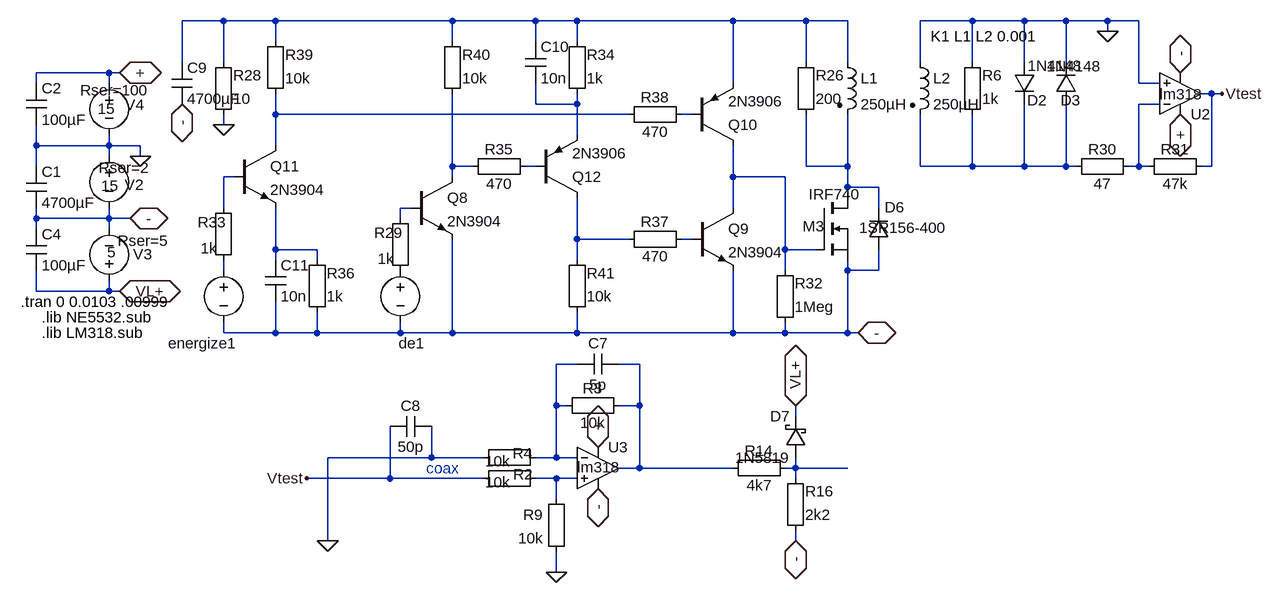
[diagram p0: schematic metal_low_power_fast_switch_5001.asc]
metal_low_power_fast_switch_5001.asc, the LTspice schematic file:
Version 4
SHEET 1 6068 1612
WIRE 96 -2432 32 -2432
WIRE 176 -2432 96 -2432
WIRE 448 -2432 176 -2432
WIRE 576 -2432 448 -2432
WIRE 640 -2432 576 -2432
WIRE 880 -2432 640 -2432
WIRE 992 -2432 880 -2432
WIRE 1056 -2432 992 -2432
WIRE 1248 -2432 1168 -2432
WIRE 1328 -2432 1248 -2432
WIRE 1392 -2432 1328 -2432
WIRE 1456 -2432 1392 -2432
WIRE 1504 -2432 1456 -2432
WIRE 1456 -2416 1456 -2432
WIRE 176 -2400 176 -2432
WIRE 448 -2400 448 -2432
WIRE 576 -2400 576 -2432
WIRE 640 -2400 640 -2432
WIRE 32 -2368 32 -2432
WIRE 96 -2368 96 -2432
WIRE 992 -2368 992 -2432
WIRE 1056 -2368 1056 -2432
WIRE 1168 -2368 1168 -2432
WIRE 1248 -2368 1248 -2432
WIRE 1328 -2368 1328 -2432
WIRE 1392 -2368 1392 -2432
WIRE -80 -2352 -192 -2352
WIRE -64 -2352 -80 -2352
WIRE -192 -2336 -192 -2352
WIRE -80 -2336 -80 -2352
WIRE 880 -2336 880 -2432
WIRE 1504 -2336 1504 -2432
WIRE 1536 -2336 1504 -2336
WIRE 1616 -2320 1600 -2320
WIRE 1632 -2320 1616 -2320
WIRE 576 -2304 576 -2336
WIRE 640 -2304 640 -2320
WIRE 640 -2304 576 -2304
WIRE 1536 -2304 1504 -2304
WIRE 176 -2288 176 -2320
WIRE 720 -2288 176 -2288
WIRE 816 -2288 800 -2288
WIRE 96 -2272 96 -2288
WIRE 640 -2256 640 -2304
WIRE -192 -2240 -192 -2272
WIRE -80 -2240 -80 -2256
WIRE -80 -2240 -192 -2240
WIRE -32 -2240 -80 -2240
WIRE 176 -2240 176 -2288
WIRE -80 -2224 -80 -2240
WIRE -32 -2224 -32 -2240
WIRE -192 -2208 -192 -2240
WIRE 448 -2208 448 -2320
WIRE 480 -2208 448 -2208
WIRE 576 -2208 560 -2208
WIRE 992 -2208 992 -2288
WIRE 1056 -2208 1056 -2288
WIRE 1056 -2208 992 -2208
WIRE 1168 -2208 1168 -2288
WIRE 1248 -2208 1248 -2288
WIRE 1248 -2208 1168 -2208
WIRE 1328 -2208 1328 -2304
WIRE 1328 -2208 1248 -2208
WIRE 1392 -2208 1392 -2304
WIRE 1392 -2208 1328 -2208
WIRE 1408 -2208 1392 -2208
WIRE 1504 -2208 1504 -2304
WIRE 1504 -2208 1488 -2208
WIRE 1520 -2208 1504 -2208
WIRE 1616 -2208 1616 -2320
WIRE 1616 -2208 1600 -2208
WIRE 112 -2192 96 -2192
WIRE 448 -2192 448 -2208
WIRE 880 -2192 880 -2240
WIRE 960 -2192 880 -2192
WIRE 1056 -2176 1056 -2208
WIRE 1104 -2176 1056 -2176
WIRE 1056 -2160 1056 -2176
WIRE 96 -2144 96 -2192
WIRE 384 -2144 368 -2144
WIRE 880 -2144 880 -2192
WIRE 1104 -2144 1104 -2176
WIRE -192 -2128 -192 -2144
WIRE -80 -2128 -80 -2144
WIRE -80 -2128 -192 -2128
WIRE -48 -2128 -80 -2128
WIRE 368 -2128 368 -2144
WIRE -192 -2112 -192 -2128
WIRE -80 -2112 -80 -2128
WIRE 640 -2096 640 -2160
WIRE 720 -2096 640 -2096
WIRE 816 -2096 800 -2096
WIRE 176 -2080 176 -2144
WIRE 240 -2080 176 -2080
WIRE 960 -2080 960 -2192
WIRE 1008 -2080 960 -2080
WIRE 176 -2064 176 -2080
WIRE 240 -2064 240 -2080
WIRE 640 -2064 640 -2096
WIRE 96 -2048 96 -2064
WIRE 960 -2048 960 -2080
WIRE 1056 -2048 1056 -2064
WIRE 1104 -2048 1104 -2080
WIRE 1104 -2048 1056 -2048
WIRE -192 -2016 -192 -2048
WIRE -80 -2016 -80 -2032
WIRE -80 -2016 -192 -2016
WIRE -64 -2016 -80 -2016
WIRE 96 -1952 96 -1968
WIRE 176 -1952 176 -2000
WIRE 176 -1952 96 -1952
WIRE 240 -1952 240 -1984
WIRE 240 -1952 176 -1952
WIRE 368 -1952 368 -1968
WIRE 368 -1952 240 -1952
WIRE 448 -1952 448 -2096
WIRE 448 -1952 368 -1952
WIRE 640 -1952 640 -1984
WIRE 640 -1952 448 -1952
WIRE 880 -1952 880 -2048
WIRE 880 -1952 640 -1952
WIRE 960 -1952 960 -1968
WIRE 960 -1952 880 -1952
WIRE 1056 -1952 1056 -2048
WIRE 1056 -1952 960 -1952
WIRE 1072 -1952 1056 -1952
WIRE 640 -1904 608 -1904
WIRE 736 -1904 704 -1904
WIRE 608 -1840 608 -1904
WIRE 624 -1840 608 -1840
WIRE 736 -1840 736 -1904
WIRE 736 -1840 704 -1840
WIRE 976 -1824 976 -1840
WIRE 416 -1760 416 -1808
WIRE 416 -1760 256 -1760
WIRE 496 -1760 416 -1760
WIRE 608 -1760 608 -1840
WIRE 608 -1760 576 -1760
WIRE 640 -1760 608 -1760
WIRE 736 -1744 736 -1840
WIRE 736 -1744 704 -1744
WIRE 880 -1744 736 -1744
WIRE 976 -1744 976 -1760
WIRE 976 -1744 960 -1744
WIRE 1056 -1744 976 -1744
WIRE 352 -1728 352 -1808
WIRE 352 -1728 224 -1728
WIRE 496 -1728 352 -1728
WIRE 608 -1728 576 -1728
WIRE 640 -1728 608 -1728
WIRE 976 -1728 976 -1744
WIRE 608 -1696 608 -1728
WIRE 256 -1632 256 -1760
WIRE 976 -1632 976 -1648
WIRE 608 -1584 608 -1616
FLAG -48 -2128 -
IOPIN -48 -2128 BiDir
FLAG -64 -2352 +
IOPIN -64 -2352 BiDir
FLAG -32 -2224 0
FLAG -64 -2016 VL+
IOPIN -64 -2016 BiDir
FLAG 976 -1632 -
IOPIN 976 -1632 BiDir
FLAG 976 -1840 VL+
IOPIN 976 -1840 BiDir
FLAG 672 -1776 +
IOPIN 672 -1776 BiDir
FLAG 672 -1712 -
IOPIN 672 -1712 BiDir
FLAG 224 -1728 Vtest
FLAG 608 -1584 0
FLAG 256 -1632 0
FLAG 32 -2304 -
IOPIN 32 -2304 BiDir
FLAG 96 -2272 0
FLAG 1568 -2288 +
IOPIN 1568 -2288 BiDir
FLAG 1568 -2352 -
IOPIN 1568 -2352 BiDir
FLAG 1072 -1952 -
IOPIN 1072 -1952 BiDir
FLAG 1632 -2320 Vtest
FLAG 1456 -2416 0
SYMBOL voltage -80 -2240 M0
WINDOW 123 0 0 Left 2
WINDOW 39 -63 34 Left 2
WINDOW 0 -53 60 Left 2
WINDOW 3 -15 62 Left 2
SYMATTR SpiceLine Rser=2
SYMATTR InstName V2
SYMATTR Value 15
SYMBOL voltage -80 -2352 M0
WINDOW 123 0 0 Left 2
WINDOW 39 -61 27 Left 2
WINDOW 0 -54 49 Left 2
WINDOW 3 -9 55 Left 2
SYMATTR SpiceLine Rser=100
SYMATTR InstName V4
SYMATTR Value 15
SYMBOL voltage -80 -2016 M180
WINDOW 123 0 0 Left 2
WINDOW 39 13 78 Left 2
WINDOW 0 37 57 Left 2
WINDOW 3 -3 60 Left 2
SYMATTR SpiceLine Rser=5
SYMATTR InstName V3
SYMATTR Value 5
SYMBOL Misc\\EuropeanCap -208 -2208 R0
SYMATTR InstName C1
SYMATTR Value 4700µF
SYMATTR SpiceLine V=400 Irms=1 Rser=.32 Lser=0
SYMBOL Misc\\EuropeanCap -208 -2336 R0
SYMATTR InstName C2
SYMATTR Value 100µF
SYMATTR SpiceLine V=400 Irms=1 Rser=.32 Lser=0
SYMBOL Misc\\EuropeanCap -208 -2112 R0
SYMATTR InstName C4
SYMATTR Value 100µF
SYMATTR SpiceLine V=400 Irms=1 Rser=.32 Lser=0
SYMBOL Misc\\EuropeanResistor 864 -1728 R270
WINDOW 0 27 56 VTop 2
WINDOW 3 5 56 VBottom 2
SYMATTR InstName R14
SYMATTR Value 4k7
SYMBOL Misc\\EuropeanResistor 960 -1632 M180
WINDOW 0 31 76 Left 2
WINDOW 3 31 40 Left 2
SYMATTR InstName R16
SYMATTR Value 2k2
SYMBOL schottky 992 -1760 R180
WINDOW 0 24 64 Left 2
WINDOW 3 24 0 Left 2
SYMATTR InstName D7
SYMATTR Value 1N5819
SYMATTR Description Diode
SYMATTR Type diode
SYMBOL Opamps\\opamp2 672 -1808 R0
WINDOW 3 -32 63 Left 2
SYMATTR Value lm318
SYMATTR InstName U3
SYMBOL Misc\\EuropeanResistor 608 -1856 M90
WINDOW 0 5 56 VBottom 2
WINDOW 3 27 56 VTop 2
SYMATTR InstName R3
SYMATTR Value 10k
SYMBOL Misc\\EuropeanCap 704 -1888 M270
WINDOW 0 32 32 VTop 2
WINDOW 3 0 32 VBottom 2
SYMATTR InstName C7
SYMATTR Value 5p
SYMATTR SpiceLine V=400 Irms=1 Rser=.32 Lser=0
SYMBOL Misc\\EuropeanCap 416 -1792 M270
WINDOW 0 32 32 VTop 2
WINDOW 3 0 32 VBottom 2
SYMATTR InstName C8
SYMATTR Value 50p
SYMATTR SpiceLine V=400 Irms=1 Rser=.32 Lser=0
SYMBOL Misc\\EuropeanResistor 480 -1744 M90
WINDOW 0 25 77 VBottom 2
WINDOW 3 6 38 VTop 2
SYMATTR InstName R2
SYMATTR Value 10k
SYMBOL Misc\\EuropeanResistor 624 -1712 M0
SYMATTR InstName R9
SYMATTR Value 10k
SYMBOL Misc\\EuropeanResistor 480 -1776 M90
WINDOW 0 25 76 VBottom 2
WINDOW 3 6 38 VTop 2
SYMATTR InstName R4
SYMATTR Value 10k
SYMBOL Misc\\EuropeanCap 16 -2368 R0
SYMATTR InstName C9
SYMATTR Value 4700µF
SYMATTR SpiceLine V=400 Irms=1 Rser=.32 Lser=0
SYMBOL Misc\\EuropeanResistor 976 -2272 M180
WINDOW 0 31 76 Left 2
WINDOW 3 31 40 Left 2
SYMATTR InstName R26
SYMATTR Value 200
SYMBOL diode 1312 -2368 R0
WINDOW 3 21 5 Left 2
WINDOW 0 20 58 Left 2
SYMATTR Value 1N4148
SYMATTR InstName D2
SYMBOL diode 1408 -2304 R180
WINDOW 0 -7 6 Left 2
WINDOW 3 -39 58 Left 2
SYMATTR InstName D3
SYMATTR Value 1N4148
SYMBOL Misc\\EuropeanResistor 80 -2272 M180
WINDOW 0 31 76 Left 2
WINDOW 3 31 40 Left 2
SYMATTR InstName R28
SYMATTR Value 10
SYMBOL nmos 1008 -2160 R0
WINDOW 0 -21 44 Left 2
WINDOW 3 -12 -5 Left 2
SYMATTR InstName M3
SYMATTR Value IRF740
SYMBOL voltage 368 -2064 M0
WINDOW 0 -38 128 Left 2
WINDOW 3 -134 119 Invisible 2
WINDOW 123 0 0 Left 2
SYMATTR InstName de1
SYMATTR Value PULSE(0 4.8 .010115 0 0 .000002 .01 1000)
SYMATTR SpiceLine Rser=0
SYMBOL npn3 384 -2192 R0
SYMATTR InstName Q8
SYMATTR Value 2N3904
SYMBOL Misc\\EuropeanResistor 352 -2032 M180
WINDOW 0 -24 74 Left 2
WINDOW 3 -19 34 Left 2
SYMATTR InstName R29
SYMATTR Value 1k
SYMBOL Opamps\\opamp2 1568 -2256 M180
WINDOW 3 -32 63 Left 2
SYMATTR Value lm318
SYMATTR InstName U2
SYMBOL Misc\\EuropeanResistor 1392 -2192 R270
WINDOW 0 27 56 VTop 2
WINDOW 3 5 56 VBottom 2
SYMATTR InstName R30
SYMATTR Value 47
SYMBOL Misc\\EuropeanResistor 1504 -2192 R270
WINDOW 0 27 56 VTop 2
WINDOW 3 5 56 VBottom 2
SYMATTR InstName R31
SYMATTR Value 47k
SYMBOL npn3 816 -2144 R0
SYMATTR InstName Q9
SYMATTR Value 2N3904
SYMBOL diode 1120 -2080 R180
WINDOW 0 -24 65 Left 2
WINDOW 3 -90 34 Left 2
SYMATTR InstName D6
SYMATTR Value 1SR156-400
SYMATTR Description Zener Diode
SYMATTR Type zener
SYMBOL pnp2 816 -2240 M180
SYMATTR InstName Q10
SYMATTR Value 2N3906
SYMBOL Misc\\EuropeanResistor 944 -1952 M180
WINDOW 0 31 76 Left 2
WINDOW 3 31 40 Left 2
SYMATTR InstName R32
SYMATTR Value 1Meg
SYMBOL voltage 96 -2064 M0
WINDOW 0 -21 128 Left 2
WINDOW 3 -134 119 Invisible 2
WINDOW 123 0 0 Left 2
SYMATTR InstName energize1
SYMATTR Value PULSE(0 4.8 .01 0 0 .0000021 .01 1000)
SYMATTR SpiceLine Rser=0
SYMBOL npn3 112 -2240 R0
SYMATTR InstName Q11
SYMATTR Value 2N3904
SYMBOL Misc\\EuropeanResistor 80 -2048 M180
WINDOW 0 -24 74 Left 2
WINDOW 3 -19 34 Left 2
SYMATTR InstName R33
SYMATTR Value 1k
SYMBOL pnp2 576 -2160 M180
SYMATTR InstName Q12
SYMATTR Value 2N3906
SYMBOL Misc\\EuropeanResistor 624 -2304 M180
WINDOW 0 31 76 Left 2
WINDOW 3 31 40 Left 2
SYMATTR InstName R34
SYMATTR Value 1k
SYMBOL Misc\\EuropeanResistor 464 -2224 M90
WINDOW 0 5 56 VBottom 2
WINDOW 3 27 56 VTop 2
SYMATTR InstName R35
SYMATTR Value 470
SYMBOL Misc\\EuropeanCap 560 -2400 R0
SYMATTR InstName C10
SYMATTR Value 10n
SYMATTR SpiceLine V=400 Irms=1 Rser=.32 Lser=0
SYMBOL Misc\\EuropeanResistor 224 -1968 M180
WINDOW 0 31 76 Left 2
WINDOW 3 31 40 Left 2
SYMATTR InstName R36
SYMATTR Value 1k
SYMBOL Misc\\EuropeanCap 160 -2064 R0
SYMATTR InstName C11
SYMATTR Value 10n
SYMATTR SpiceLine V=400 Irms=1 Rser=.32 Lser=0
SYMBOL Misc\\EuropeanResistor 816 -2080 M270
WINDOW 0 27 56 VTop 2
WINDOW 3 5 56 VBottom 2
SYMATTR InstName R37
SYMATTR Value 470
SYMBOL Misc\\EuropeanResistor 704 -2304 M90
WINDOW 0 5 56 VBottom 2
WINDOW 3 27 56 VTop 2
SYMATTR InstName R38
SYMATTR Value 470
SYMBOL Misc\\EuropeanResistor 160 -2304 M180
WINDOW 0 31 76 Left 2
WINDOW 3 31 40 Left 2
SYMATTR InstName R39
SYMATTR Value 10k
SYMBOL Misc\\EuropeanResistor 432 -2304 M180
WINDOW 0 31 76 Left 2
WINDOW 3 31 40 Left 2
SYMATTR InstName R40
SYMATTR Value 10k
SYMBOL Misc\\EuropeanResistor 624 -1968 M180
WINDOW 0 31 76 Left 2
WINDOW 3 31 40 Left 2
SYMATTR InstName R41
SYMATTR Value 10k
SYMBOL ind2 1040 -2384 R0
SYMATTR InstName L1
SYMATTR Value 250µH
SYMATTR SpiceLine Rser=.4 Cpar=20p
SYMATTR Type ind
SYMBOL ind2 1152 -2384 R0
SYMATTR InstName L2
SYMATTR Value 250µH
SYMATTR SpiceLine Rser=.4 Cpar=20p
SYMATTR Type ind
SYMBOL Misc\\EuropeanResistor 1232 -2272 M180
WINDOW 0 31 76 Left 2
WINDOW 3 31 40 Left 2
SYMATTR InstName R6
SYMATTR Value 1k
TEXT -216 -2000 Left 2 !.tran 0 0.0103 .00999
TEXT -184 -1976 Left 2 !.lib NE5532.sub
TEXT -184 -1952 Left 2 !.lib LM318.sub
TEXT 408 -1744 Left 2 ;coax
TEXT 1184 -2408 Left 2 !K1 L1 L2 0.001

The netlist it stands for:
* metal_low_power_fast_switch_5001.asc
V2 0 - 15 Rser=2
V4 + 0 15 Rser=100
V3 VL+ - 5 Rser=5
C1 0 - 4700µF V=400 Irms=1 Rser=.32 Lser=0
C2 + 0 100µF V=400 Irms=1 Rser=.32 Lser=0
C4 - VL+ 100µF V=400 Irms=1 Rser=.32 Lser=0
R14 N018 N019 4k7
R16 - N019 2k2
D7 N019 VL+ 1N5819
XU3 N020 N017 + - N018 lm318  ; pins In+ In- V+ V- OUT
R3 N017 N018 10k
C7 N018 N017 5p V=400 Irms=1 Rser=.32 Lser=0
C8 0 Vtest 50p V=400 Irms=1 Rser=.32 Lser=0
R2 Vtest N020 10k
R9 N020 0 10k
R4 0 N017 10k
C9 N001 - 4700µF V=400 Irms=1 Rser=.32 Lser=0
R26 N008 N001 200
D2 0 N009 1N4148
D3 N009 0 1N4148
R28 0 N001 10
M3 N008 N011 - - IRF740
V§de1 P001 - PULSE(0 4.8 .010115 0 0 .000002 .01 1000) Rser=0
Q8 N006 N012 - 0 2N3904
R29 P001 N012 1k
XU2 0 N003 + - Vtest lm318  ; pins In+ In- V+ V- OUT
R30 N009 N003 47
R31 N003 Vtest 47k
Q9 N011 N014 - 0 2N3904
D6 - N008 1SR156-400
Q10 N011 N005 N001 0 2N3906
R32 - N011 1Meg
V§energize1 N016 - PULSE(0 4.8 .01 0 0 .0000021 .01 1000) Rser=0
Q11 N004 N010 N015 0 2N3904
R33 N016 N010 1k
Q12 N013 N007 N002 0 2N3906
R34 N002 N001 1k
R35 N006 N007 470
C10 N001 N002 10n V=400 Irms=1 Rser=.32 Lser=0
R36 - N015 1k
C11 N015 - 10n V=400 Irms=1 Rser=.32 Lser=0
R37 N014 N013 470
R38 N004 N005 470
R39 N004 N001 10k
R40 N006 N001 10k
R41 - N013 10k
L1 N001 N008 250µH Rser=.4 Cpar=20p
L2 0 N009 250µH Rser=.4 Cpar=20p
R6 N009 0 1k
.model D D
.lib standard.dio
.model NPN NPN
.model PNP PNP
.lib standard.bjt
.model NMOS NMOS
.model PMOS PMOS
.lib standard.mos
.tran 0 0.0103 .00999
.lib NE5532.sub
.lib LM318.sub
* coax
K1 L1 L2 0.001
.backanno
.end